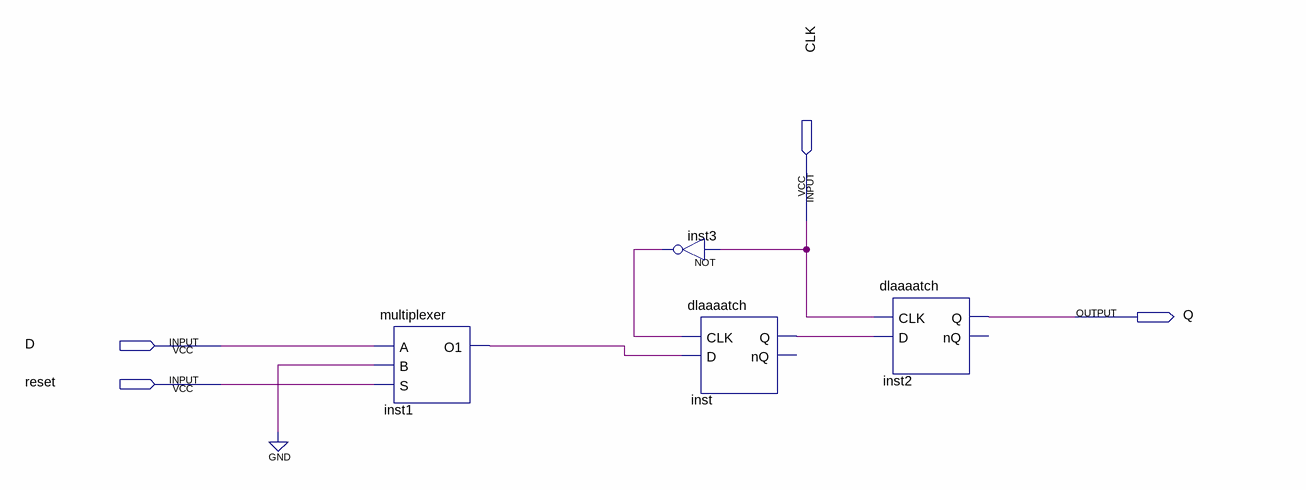
[diagram p0: schematic sheet]
// Quartus schematic sdflipflop.bdf as structural Verilog: 4 symbols, 4 pins
module sdflipflop (
  input  CLK,
  input  D,
  input  reset,
  output Q
);

  wire inst1_o1, inst3_out, inst_q;

  multiplexer inst1 (.A(D), .B(1'b0), .S(reset), .O1(inst1_o1));
  not inst3 (inst3_out, CLK);
  dlaaaatch inst (.CLK(inst3_out), .D(inst1_o1), .Q(inst_q));  // open: nQ
  dlaaaatch inst2 (.CLK(CLK), .D(inst_q), .Q(Q));  // open: nQ
endmodule
